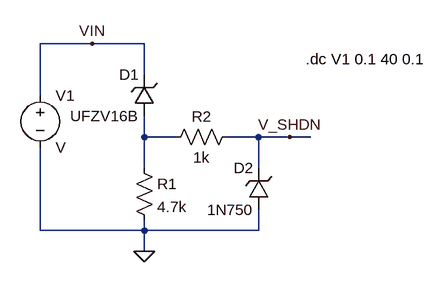
[diagram p0: schematic ovp_zener_simulation.asc]
ovp_zener_simulation.asc, the LTspice schematic file:
Version 4
SHEET 1 880 680
WIRE 32 32 -48 32
WIRE 112 32 32 32
WIRE 112 80 112 32
WIRE -48 112 -48 32
WIRE 112 176 112 144
WIRE 160 176 112 176
WIRE 288 176 240 176
WIRE 336 176 288 176
WIRE 368 176 336 176
WIRE 112 224 112 176
WIRE 288 224 288 176
WIRE -48 320 -48 192
WIRE 112 320 112 304
WIRE 112 320 -48 320
WIRE 288 320 288 288
WIRE 288 320 112 320
WIRE 112 352 112 320
FLAG 112 352 0
FLAG 32 32 VIN
FLAG 336 176 V_SHDN
SYMBOL zener 128 144 R180
WINDOW 0 24 64 Left 2
WINDOW 3 24 0 Left 2
SYMATTR InstName D1
SYMATTR Value UFZV16B
SYMBOL zener 304 288 R180
WINDOW 0 24 64 Left 2
WINDOW 3 24 0 Left 2
SYMATTR InstName D2
SYMATTR Value 1N750
SYMBOL res 96 208 R0
SYMATTR InstName R1
SYMATTR Value 4.7k
SYMBOL res 256 160 R90
WINDOW 0 0 56 VBottom 2
WINDOW 3 32 56 VTop 2
SYMATTR InstName R2
SYMATTR Value 1k
SYMBOL voltage -48 96 R0
SYMATTR InstName V1
TEXT 360 56 Left 2 !.dc V1 0.1 40 0.1

The netlist it stands for:
* ovp_zener_simulation.asc
D1 N001 VIN UFZV16B
D2 0 V_SHDN 1N750
R1 N001 0 4.7k
R2 V_SHDN N001 1k
V1 VIN 0 V
.model D D
.lib standard.dio
.dc V1 0.1 40 0.1
.backanno
.end

* Results of the author's LTspice run, read from the files saved beside the schematic
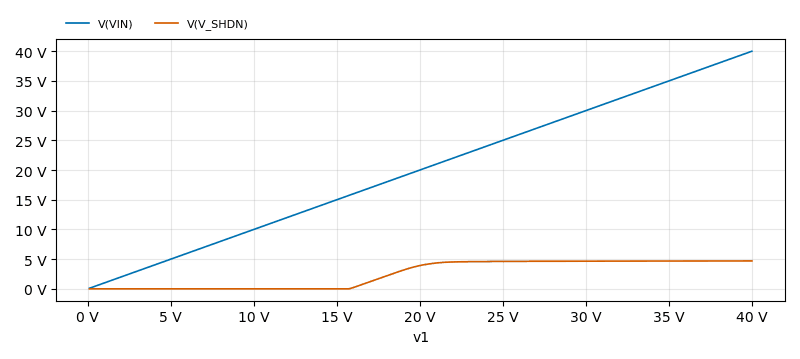
[diagram p1: DC transfer characteristic of ovp_zener_simulation.asc, plotted from the saved traces]
* DC transfer characteristic, 1 run:
*   V(VIN): 100 mV at v1=100 mV, 40 V at v1=40 V, min 100 mV, max 40 V
*   V(V_SHDN): 7.218 nV at v1=100 mV, 4.698 V at v1=40 V, min 7.218 nV, max 4.698 V